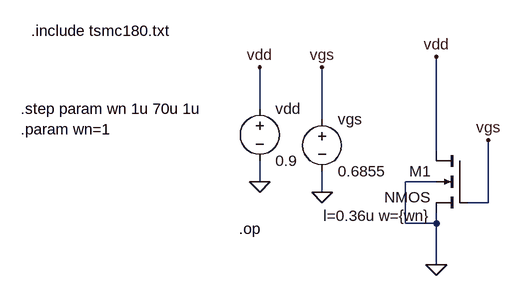
[diagram p0: schematic current mirror model nmos.asc]
current mirror model nmos.asc, the LTspice schematic file:
Version 4
SHEET 1 880 680
WIRE 16 80 16 16
WIRE 112 96 112 16
WIRE 288 144 288 0
WIRE 16 192 16 160
WIRE 288 192 240 192
WIRE 112 208 112 176
WIRE 368 224 368 128
WIRE 368 224 336 224
WIRE 240 256 240 192
WIRE 288 256 288 240
WIRE 288 256 240 256
WIRE 288 320 288 256
FLAG 288 320 0
FLAG 16 192 0
FLAG 112 208 0
FLAG 16 16 vdd
FLAG 112 16 vgs
FLAG 368 128 vgs
FLAG 288 0 vdd
SYMBOL nmos4 336 144 M0
WINDOW 123 56 100 Left 2
SYMATTR Value2 l=0.36u w={wn}
SYMATTR InstName M1
SYMBOL voltage 16 64 R0
WINDOW 123 0 0 Left 0
WINDOW 39 0 0 Left 0
SYMATTR InstName vdd
SYMATTR Value 0.9
SYMBOL voltage 112 80 R0
WINDOW 123 0 0 Left 0
WINDOW 39 0 0 Left 0
SYMATTR InstName vgs
SYMATTR Value 0.6855
TEXT -16 264 Left 2 !.op
TEXT -336 -40 Left 2 !.include tsmc180.txt
TEXT -352 80 Left 2 !.step param wn 1u 70u 1u\n.param wn=1

The netlist it stands for:
* current mirror model nmos.asc
M1 vdd vgs 0 0 NMOS l=0.36u w={wn}
vdd vdd 0 0.9
vgs vgs 0 0.6855
.model NMOS NMOS
.model PMOS PMOS
.lib standard.mos
.op
.include tsmc180.txt
.step param wn 1u 70u 1u
.param wn=1
.backanno
.end